# EAGLE design BigBrdSL (EAGLE 9.6.2)
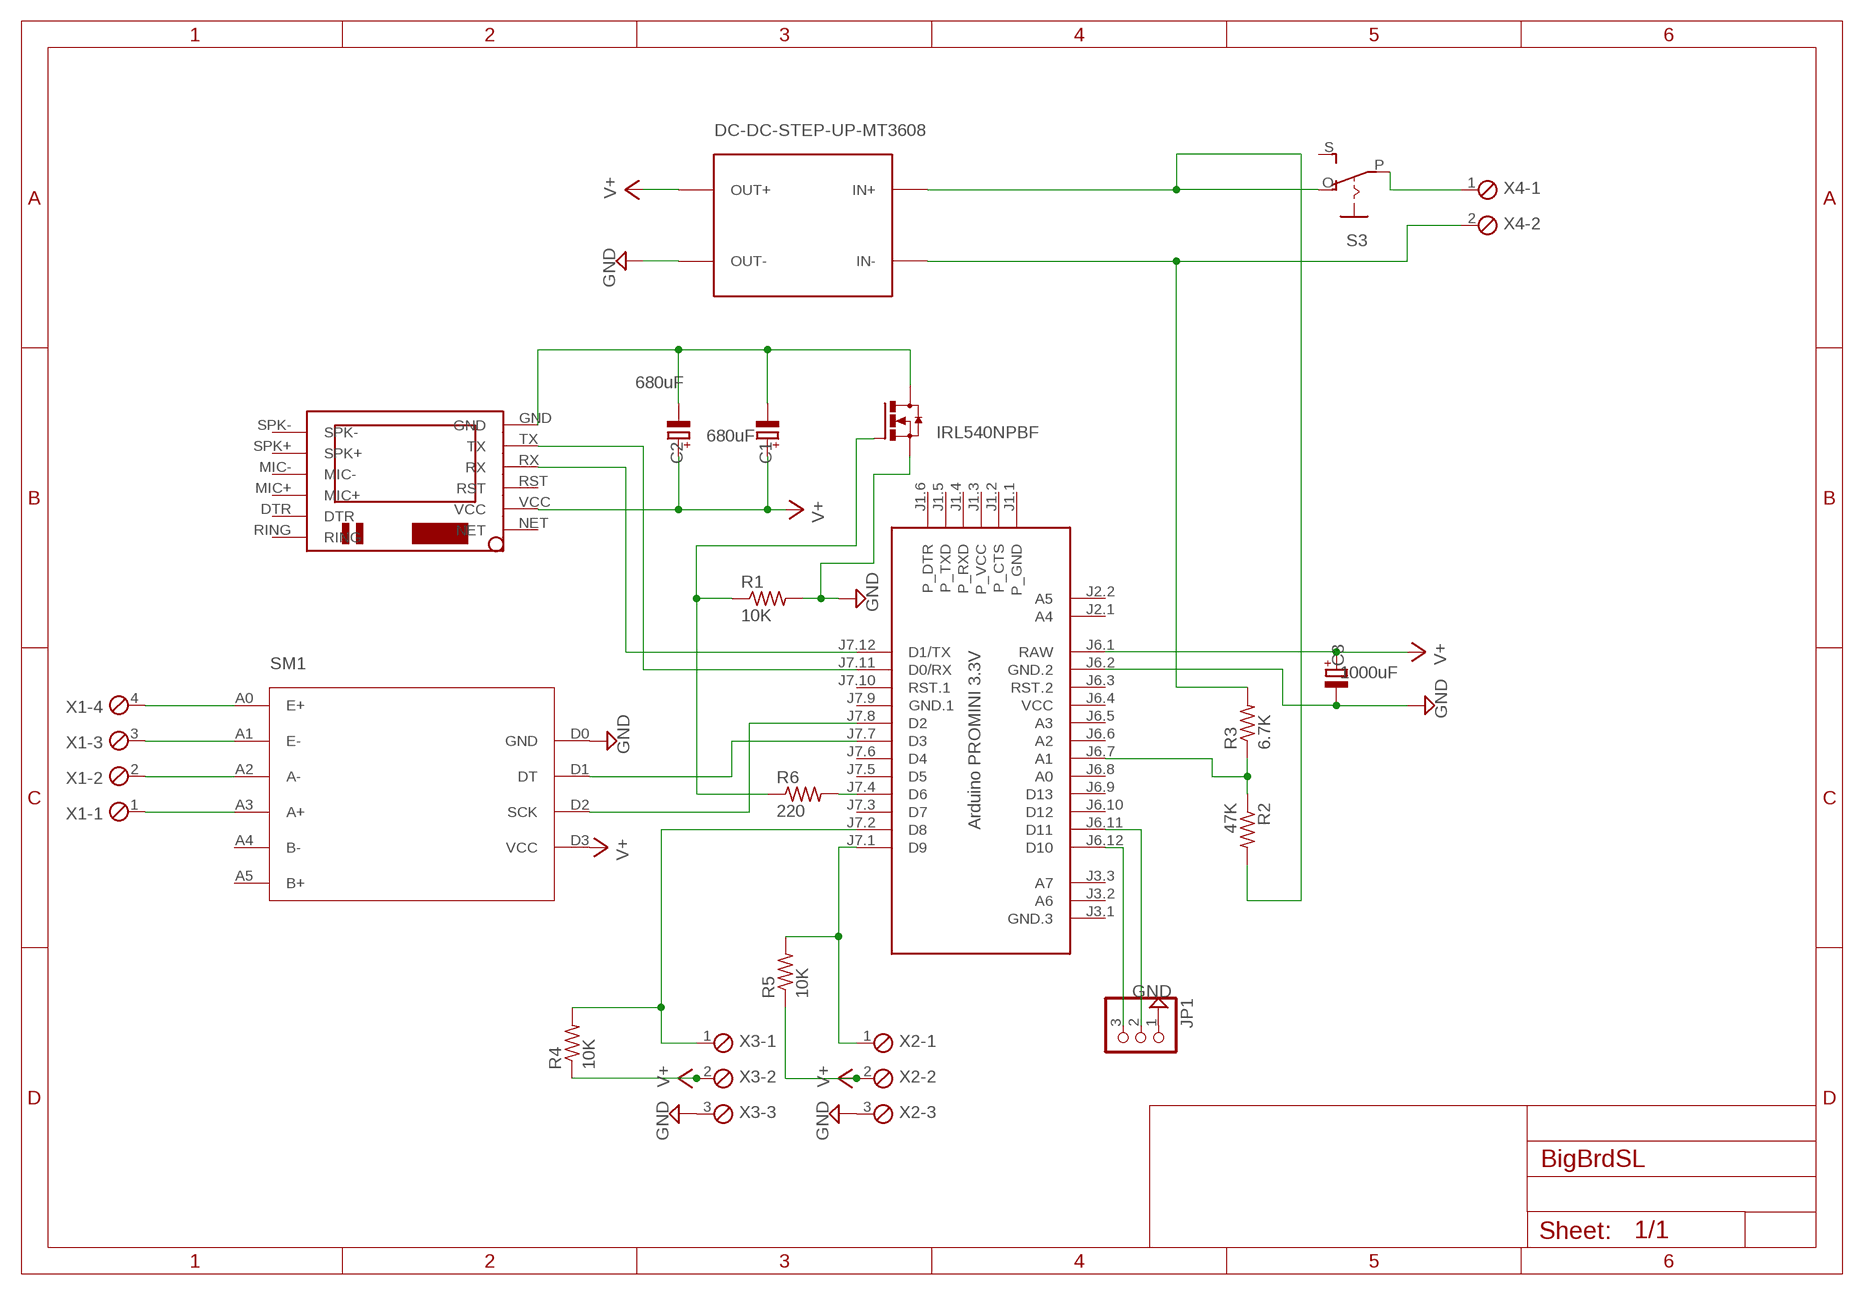
[diagram p0: schematic, sheet 1]

## Parts
C1  680uF  CPOL-EUE3.5-8  [E3,5-8]
C2  680uF  CPOL-EUE3.5-8  [E3,5-8]
C3  1000uF  CPOL-EUE3.5-8  [E3,5-8]
IRL540NPBF  IRF520NPBF  [TO-220]
JP1  PINHD-1X3  [1X03]
M1  ARDUINO-PRO-MINI-5.0V  [ARDUINO-PRO-MINI]
MT36-08  DC-DC-STEP-UP-MT3608  [DC-DC-STEP-UP-MT3608]
R1  10K  R-US_0207/7  [0207/7]
R2  47K  R-US_0207/7  [0207/7]
R3  6.7K  R-US_0207/7  [0207/7]
R4  10K  R-US_0207/7  [0207/7]
R5  10K  R-US_0207/7  [0207/7]
R6  220  R-US_0207/7  [0207/7]
S3  EG1218S  [EG1218]
SM1  HX711  [HX711]
U$3  SIM800LMODULE  [SIM800LMODULE]
X1  MPT4  [4POL254]
X2  MPT3  [3POL254]
X3  MPT3  [3POL254]
X4  MPT2  [2POL254]

## Nets
GND: C3.- IRL540NPBF.S JP1.1 M1.J6.2(GND.2) MT36-08.OUT- R1.2 SM1.D0(GND) X2.3 X3.3
N$1: M1.J7.1(D9) R5.2 X2.1
N$2: MT36-08.IN+ R2.2 S3.O
N$3: IRL540NPBF.G R1.1 R6.1
N$4: M1.J7.11(D0/RX) U$3.TX
N$5: M1.J7.7(D3) SM1.D1(DT)
N$6: M1.J7.12(D1/TX) U$3.RX
N$7: M1.J7.8(D2) SM1.D2(SCK)
N$8: JP1.3 M1.J6.12(D10)
N$9: M1.J7.4(D6) R6.2
N$10: MT36-08.IN- R3.2 X4.2
N$11: M1.J6.7(A1) R2.1 R3.1
N$12: C1.- C2.- IRL540NPBF.D U$3.GND
N$13: JP1.2 M1.J6.11(D11)
N$14: SM1.A0(E+) X1.4
N$15: SM1.A1(E-) X1.3
N$16: SM1.A2(A-) X1.2
N$17: SM1.A3(A+) X1.1
N$18: S3.P X4.1
N$19: M1.J7.2(D8) R4.2 X3.1
V+: C1.+ C2.+ C3.+ M1.J6.1(RAW) MT36-08.OUT+ R4.1 R5.1 SM1.D3(VCC) U$3.VCC X2.2 X3.2
Unconnected: M1.J1.1(P_GND) M1.J1.2(P_CTS) M1.J1.3(P_VCC) M1.J1.4(P_RXD) M1.J1.5(P_TXD) M1.J1.6(P_DTR) M1.J2.1(A4) M1.J2.2(A5) M1.J3.1(GND.3) M1.J3.2(A6) M1.J3.3(A7) M1.J6.3(RST.2) M1.J6.5(A3) M1.J6.6(A2) M1.J6.8(A0) M1.J6.9(D13) M1.J6.10(D12) M1.J7.3(D7) M1.J7.5(D5) M1.J7.6(D4) M1.J7.10(RST.1) S3.S SM1.A4(B-) SM1.A5(B+) U$3.DTR U$3.MIC+ U$3.MIC- U$3.NET U$3.RING U$3.RST U$3.SPK+ U$3.SPK-

## Notes on the sheet
- Arduino PROMINI 3.3V

## Power pins joined to a net without a drawn wire
GND.1: M1.J7.9(GND.1)
VCC: M1.J6.4(VCC)

## Library data of the parts
C1-C3 = rcl:CPOL-EU: POLARIZED CAPACITOR, European symbol; SPICEPREFIX: C
IRL540NPBF = Transistor:IRF520NPBF: MOSFET N-CH 100V 9.7A TO-220AB Manufacturer's datasheet <https://www.infineon.com/dgdl/irf520npbf.pdf?fileId=5546d462533600a4015355e340711985>; CREATED_BY: PCBLayout.com; DIGIKEY_PART_NUMBER: IRlL540NPBF; MANUFACTURER: Infineon Technologies; MPN: IRL540NPBF; PACKAGE: TO-220
JP1 = adafruit:PINHD-1X3: PIN HEADER
M1 = diy-modules:ARDUINO-PRO-MINI-*: Arduino Pro Mini and compatible devices More details available here: https://www.arduino.cc/en/Main/ArduinoBoardProMini Click here to find device on ebay.com <http://www.ebay.com/sch/arduino+pro+mini>
MT36-08 = diy-modules:DC-DC-STEP-UP-MT3608: DC/DC Step-Up Regulator based on MT3608 chip MT3608 datasheet available here: https://www.olimex.com/Products/Breadboarding/BB-PWR-3608/resources/MT3608.pdf Click here to find device on ebay.com <http://www.ebay.com/sch/mt3608+module>
R1-R6 = adafruit:R-US_: RESISTOR, American symbol
S3 = adafruit:EG1218: SLIDING SWITCH 0.1" spacing through hole, vertical SPDT slide switch http://www.ladyada.net/library/pcb/eaglelibrary.html
SM1 = hx711:HX711: HX711 module is a Load Cell Amplifier breakout board for the HX711 IC that allows you to easily read load cells to measure weight. This module uses 24 high precision A/D converter chip HX711. It is a specially designed for the high precision electronic scale design, with two analog input channel, the internal integration of 128 times the programmable gain amplifier. The input circuit can be configured to provide a bridge type pressure bridge (such as pressure, weighing sensor mode), is of high precision, low cost is an ideal sampling front-end module.
U$3 = SIM800LMODULE:SIM800LMODULE: SIM800L Module
X1 = con-phoenix-254:MPT4: PHOENIX CONNECTOR; OC_FARNELL: unknown; OC_NEWARK: unknown
X2 X3 = con-phoenix-254:MPT3: PHOENIX CONNECTOR; OC_FARNELL: unknown; OC_NEWARK: unknown
X4 = con-phoenix-254:MPT2: PHOENIX CONNECTOR; OC_FARNELL: unknown; OC_NEWARK: unknown

## Board
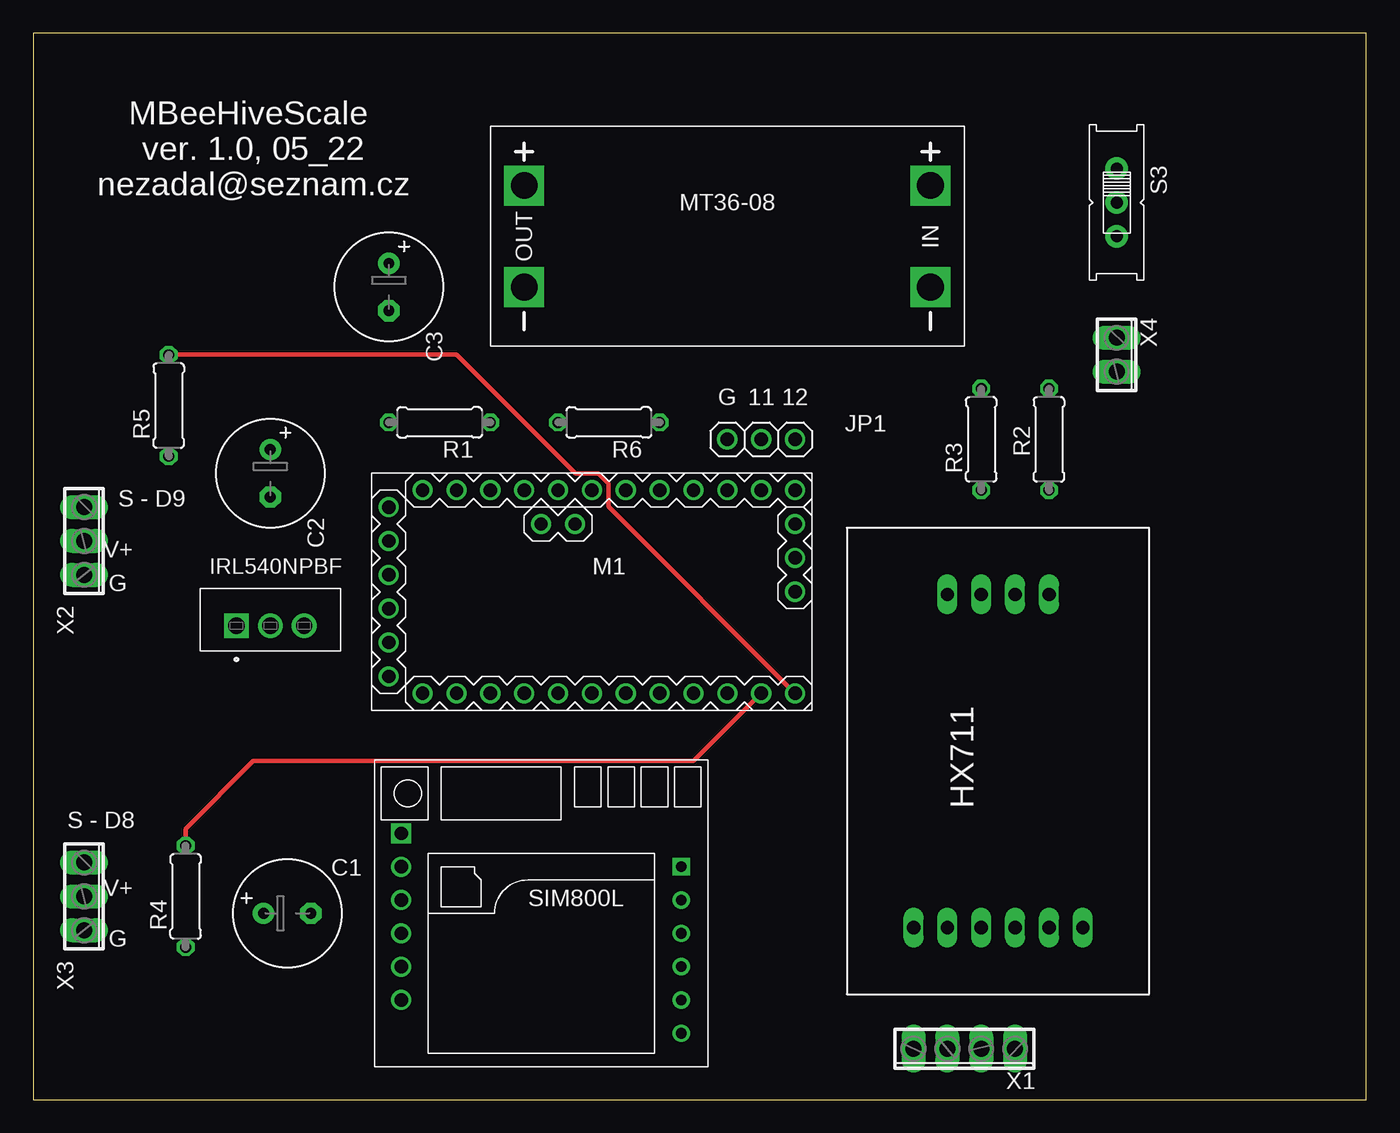
[diagram p1: board, top side]
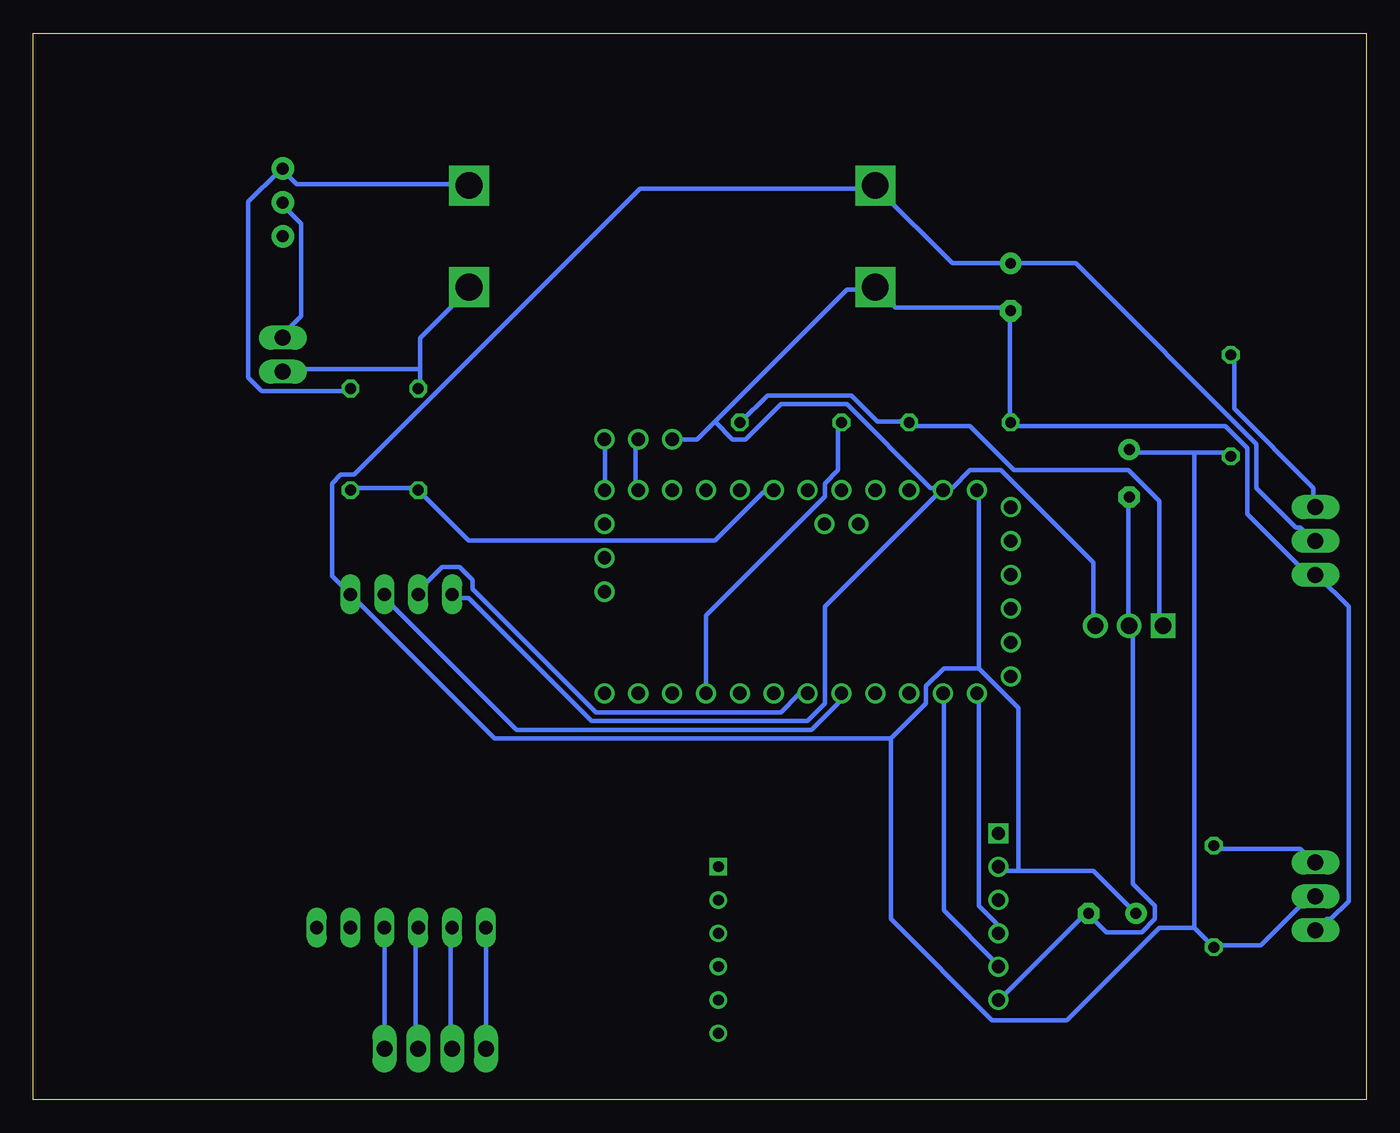
[diagram p2: board, bottom side, seen from below]

Size 100 x 80 mm. Coordinates in mm from the lower left corner, seen from the top.
Outline: 0,0 100,0 100,80 0,80 0,0
Copper layers (1*16): Top 0.035mm / dielectric 1.5mm / Bottom 0.035mm
Design rules "default *": minimum track width 14mil, minimum drill 0.35mm, track to track 12mil, track to pad 12mil, pad to pad 12mil, via to via 12mil, smd to smd 6mil, copper to edge 40mil, drill to drill 6mil, minimum pad ring 10mil, minimum via ring 8mil, stop-mask expansion 4mil, vias tented up to drill 0mil, thermal gap 10mil

### Footprints (pad centres in the part's own frame; a part is rotated, then mirrored left to right if it is on the bottom)
E3,5-8 = drill 0.813 pad 1.6: + -1.778,0 | drill 0.813 pad 1.6 octagon: - 1.778,0
TO-220 = drill 1.23 pad 1.85: D 2.54,0; S 5.08,0 | drill 1.23 pad 1.85 square: G 0,0
1X03 = drill 1.016: 1 -2.54,0; 2 0,0; 3 2.54,0
ARDUINO-PRO-MINI = drill 1: J1.1 -15.24,6.35; J1.2 -15.24,3.81; J1.3 -15.24,1.27; J1.4 -15.24,-1.27; J1.5 -15.24,-3.81; J1.6 -15.24,-6.35; J2.1 -1.27,5.08; J2.2 -3.81,5.08; J3.1 15.24,0; J3.2 15.24,2.54; J3.3 15.24,5.08; J6.1 -12.7,7.62; J6.2 -10.16,7.62; J6.3 -7.62,7.62; J6.4 -5.08,7.62; J6.5 -2.54,7.62; J6.6 0,7.62; J6.7 2.54,7.62; J6.8 5.08,7.62; J6.9 7.62,7.62; J6.10 10.16,7.62; J6.11 12.7,7.62; J6.12 15.24,7.62; J7.1 15.24,-7.62; J7.2 12.7,-7.62; J7.3 10.16,-7.62; J7.4 7.62,-7.62; J7.5 5.08,-7.62; J7.6 2.54,-7.62; J7.7 0,-7.62; J7.8 -2.54,-7.62; J7.9 -5.08,-7.62; J7.10 -7.62,-7.62; J7.11 -10.16,-7.62; J7.12 -12.7,-7.62
DC-DC-STEP-UP-MT3608 = drill 2 pad 2.8 square: IN+ 15.24,3.81; IN- 15.24,-3.81; OUT+ -15.24,3.81; OUT- -15.24,-3.81
0207/7 = drill 0.813 octagon: 1 -3.81,0; 2 3.81,0
EG1218 = drill 0.9 pad 1.676: O -2.54,0; P 0,0; S 2.54,0
HX711 = drill 1 long: A0 -12.5,6.35; A1 -12.5,3.81; A2 -12.5,1.27; A3 -12.5,-1.27; A4 -12.5,-3.81; A5 -12.5,-6.35; D0 12.5,3.81; D1 12.5,1.27; D2 12.5,-1.27; D3 12.5,-3.81
SIM800LMODULE = drill 0.8: DTR 10.5,1; MIC+ 10.5,-1.5; MIC- 10.5,-4; SPK+ 10.5,-6.5; SPK- 10.5,-9 | drill 1: GND -10.5,-6.5; RST -10.5,1; RX -10.5,-1.5; TX -10.5,-4; VCC -10.5,3.5 | drill 1 square: NET -10.5,6 | drill 0.8 square: RING 10.5,3.5
4POL254 = drill 1.2 long: 1 -3.81,0; 2 -1.27,0; 3 1.27,0; 4 3.81,0
3POL254 = drill 1.2 long: 1 -2.54,0; 2 0,0; 3 2.54,0
2POL254 = drill 1.2 long: 1 -1.27,0; 2 1.27,0

### Placement (x,y rotation side)
C1  19.05,13.97 0 top
C2  17.78,46.99 270 top
C3  26.67,60.96 270 top
IRL540NPBF  15.24,35.56 0 top
JP1  54.61,49.53 0 top
M1  41.91,38.1 0 top
MT36-08  52.07,64.77 0 top
R1  30.48,50.8 180 top
R2  76.2,49.53 90 top
R3  71.12,49.53 90 top
R4  11.43,15.24 90 top
R5  10.16,52.07 90 top
R6  43.18,50.8 180 top
S3  81.28,67.31 270 top
SM1  72.39,25.4 90 top
U$3  38.1,13.97 0 top
X1  69.85,3.81 180 top
X2  3.81,41.91 270 top
X3  3.81,15.24 270 top
X4  81.28,55.88 270 top

### Tracks (layer width: path | path; a pad name or v marks a point on that pad's centre or on a via)
GND
  Bottom 0.356: M1.J6.2 31.7,45.9 31.04,45.9 29.72,47.22 27.41,47.22 20.47,40.28 20.47,35.66 IRL540NPBF.S | SM1.D0 68.35,37.64 67.36,37.64 58.12,28.4 41.94,28.4 40.62,29.72 40.62,36.98 32.03,45.57 M1.J6.2 | X3.3 2.97,13.54 2.64,13.54 1.32,14.86 1.32,36.98 3.63,39.29 X2.3 3.96,39.62 4.62,39.62 8.91,43.92 8.91,48.87 10.57,50.52 26.42,50.52 R1.2 26.75,50.85 26.75,59.11 C3.- 26.75,59.44 35.33,59.44 36.65,60.76 MT36-08.OUT- 36.98,60.76 38.96,60.76 48.87,50.85 | JP1.1 50.19,49.53 48.87,50.85 | 48.87,50.85 47.55,49.53 46.56,49.53 43.92,52.17 38.96,52.17 32.69,45.9 32.03,45.9 M1.J6.2
N$1
  Top 0.356: R5.2 31.75,55.88 40.67,46.96 42.42,46.96 43.15,46.23 43.15,44.48 M1.J7.1
  Bottom 0.356: R5.2 9.91,55.8 9.91,51.84 3.96,45.9 3.96,44.58 X2.1
N$2
  Bottom 0.356: R2.2 76.28,53.16 82.88,53.16 83.87,54.15 83.87,67.36 81.56,69.67 S3.O 81.23,69.67 80.24,68.68 67.36,68.68 MT36-08.IN+
N$3
  Bottom 0.356: R6.1 46.89,50.85 44.91,52.83 38.63,52.83 36.65,50.85 34.34,50.85 R1.1 34.01,50.52 29.72,50.52 26.42,47.22 17.83,47.22 15.52,44.91 15.52,35.66 IRL540NPBF.G
N$4
  Bottom 0.356: U$3.TX 27.74,10.24 31.7,14.2 31.7,30.38 M1.J7.11
N$5
  Bottom 0.356: M1.J7.7 41.94,30.38 42.6,30.38 43.92,29.06 57.78,29.06 67.03,38.3 67.03,38.96 68.02,39.95 69.34,39.95 71.32,37.97 SM1.D1
N$6
  Bottom 0.356: U$3.RX 27.74,12.55 27.74,13.21 29.06,14.53 29.06,30.38 M1.J7.12
N$7
  Bottom 0.356: M1.J7.8 39.62,30.38 39.62,29.72 41.6,27.74 63.73,27.74 73.64,37.64 SM1.D2
N$8
  Bottom 0.356: M1.J6.12 57.12,45.9 57.12,49.53 JP1.3
N$9
  Bottom 0.356: M1.J7.4 49.53,36.32 40.62,45.24 40.62,46.23 39.62,47.22 39.62,50.52 R6.2
N$10
  Bottom 0.356: 70.99,54.81 70.99,57.12 67.36,60.76 MT36-08.IN- | 70.99,54.81 70.99,53.49 R3.2 | 70.99,54.81 81.23,54.81 X4.2
N$11
  Bottom 0.356: R2.1 75.95,45.9 71.32,45.9 R3.1 70.99,45.57 67.36,41.94 48.87,41.94 45.24,45.57 44.58,45.57 M1.J6.7
N$12
  Bottom 0.356: C2.- 17.83,44.91 17.83,35.66 IRL540NPBF.D 17.5,35.33 17.5,16.18 15.85,14.53 15.85,13.54 16.84,12.55 19.48,12.55 20.8,13.87 C1.- 21.13,13.87 27.41,7.59 U$3.GND
N$13
  Bottom 0.356: M1.J6.11 54.81,45.9 54.81,49.53 JP1.2
N$14
  Bottom 0.356: X1.4 SM1.A0
N$15
  Bottom 0.356: SM1.A1 68.68,12.88 68.68,3.96 X1.3
N$16
  Bottom 0.356: SM1.A2 71.32,12.88 71.32,3.96 X1.2
N$17
  Bottom 0.356: SM1.A3 73.64,12.88 73.64,3.96 X1.1
N$18
  Bottom 0.356: S3.P 81.23,67.03 79.91,65.71 79.91,58.78 81.23,57.45 X4.1
N$19
  Top 0.356: M1.J7.2 49.53,25.4 16.51,25.4 11.43,20.32 R4.2
  Bottom 0.356: R4.2 11.23,18.82 4.95,18.82 3.96,17.83 X3.1
V+
  Bottom 0.356: X2.2 3.96,41.94 4.95,42.93 5.28,42.93 8.26,45.9 8.26,49.2 21.79,62.74 C3.+ 31.04,62.74 36.65,68.35 MT36-08.OUT+ 36.98,68.35 54.48,68.35 75.95,46.89 76.94,46.89 77.6,46.23 77.6,39.29 76.28,37.97 SM1.D3 75.95,37.64 65.38,27.08 35.66,27.08 | 12.88,48.54 17.5,48.54 C2.+ | 12.88,48.54 10.24,48.54 R5.1 | X3.2 3.96,15.52 7.92,11.56 11.23,11.56 R4.1 12.88,12.88 | 12.88,12.88 12.88,48.54 | 26.09,17.17 20.47,17.17 C1.+ | 26.09,17.17 27.41,17.17 U$3.VCC | 29.06,32.36 29.06,45.57 M1.J6.1 | 29.06,32.36 26.09,29.39 26.09,17.17 | 35.66,27.08 33.02,29.72 33.02,31.04 31.7,32.36 29.06,32.36 | 12.88,12.88 15.52,12.88 22.45,5.94 28.07,5.94 35.66,13.54 35.66,27.08

### Text on the board
tNames: MBeeHiveScale / ver. 1.0, 05_22 / nezadal@seznam.cz | G | 11 | 12 | S - D9 | V+ | G | S - D8 | V+ | G